# EAGLE design eblock expansion (EAGLE 5.04)
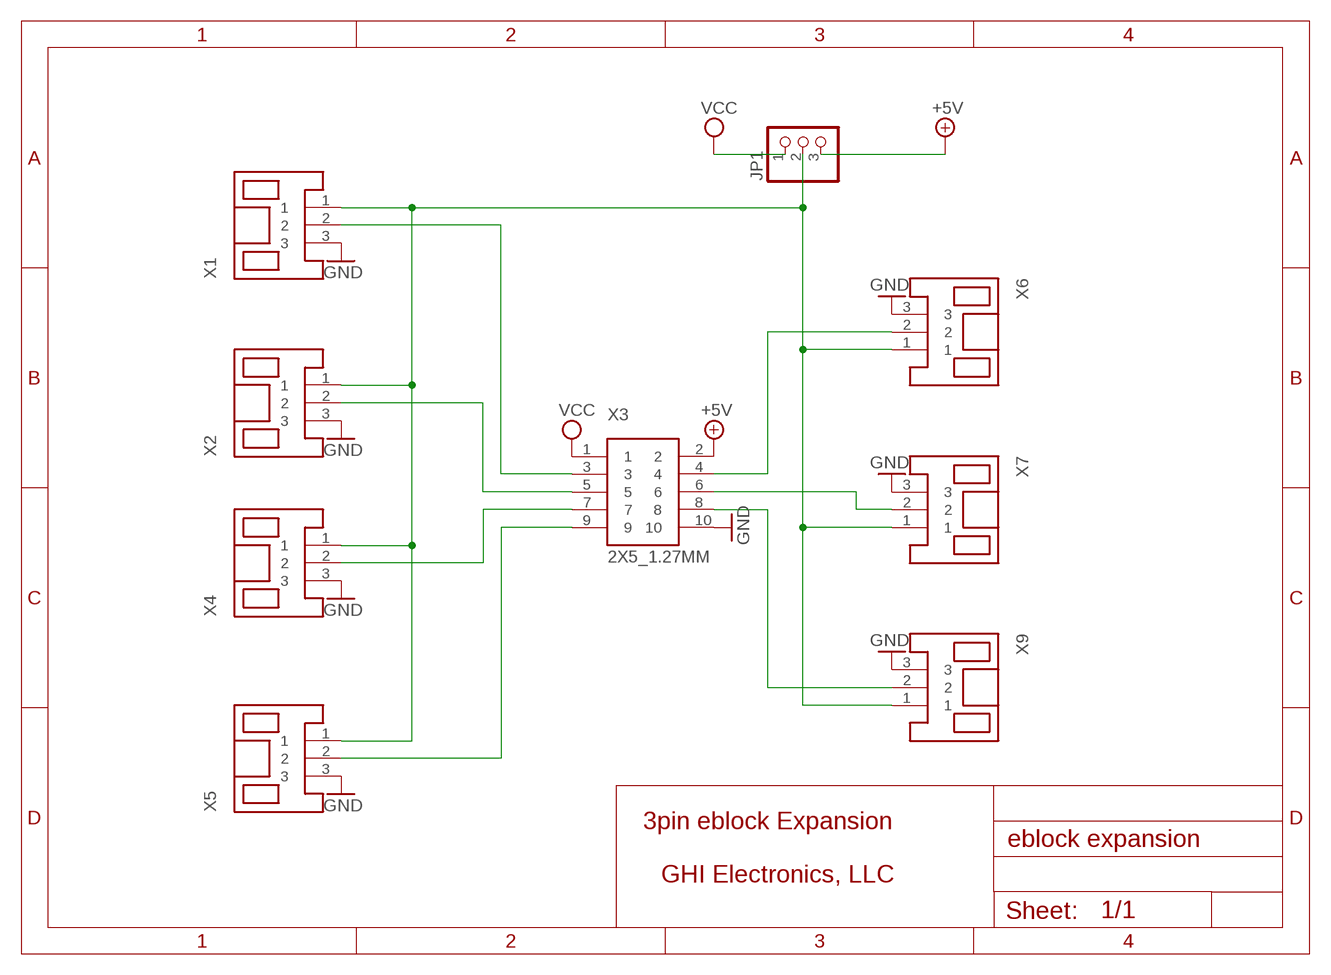
[diagram p0: schematic, sheet 1]

## Parts
JP1  PINHD-1X3  [1X03]
X1  JST3PIN_TH  [CON_JST_3PIN_TH]
X2  JST3PIN_TH  [CON_JST_3PIN_TH]
X3  2X5_1.27MM  [2X5_1.27MM]
X4  JST3PIN_TH  [CON_JST_3PIN_TH]
X5  JST3PIN_TH  [CON_JST_3PIN_TH]
X6  JST3PIN_TH  [CON_JST_3PIN_TH]
X7  JST3PIN_TH  [CON_JST_3PIN_TH]
X9  JST3PIN_TH  [CON_JST_3PIN_TH]

## Nets
+5V [power]: JP1.3 X3.2
GND [power]: X1.3 X2.3 X3.10 X4.3 X5.3 X6.3 X7.3 X9.3
N$1: X1.2 X3.3
N$2: X2.2 X3.5
N$3: X3.7 X4.2
N$4: X3.9 X5.2
N$5: X3.4 X6.2
N$6: X3.8 X9.2
N$7: X3.6 X7.2
N$8: JP1.2 X1.1 X2.1 X4.1 X5.1 X6.1 X7.1 X9.1
VCC [power]: JP1.1 X3.1

## Notes on the sheet
- 3pin eblock Expansion
- GHI Electronics, LLC

## Library data of the parts
JP1 = pinhead:PINHD-1X3: PIN HEADER
X1 X2 X4-X7 X9 = GHI:JST3PIN_TH
X3 = GHI:2X5_1.27MM

## Net classes
0 default: width 0.254 mm, drill 0.381 mm, clearance 0.203 mm

## Board
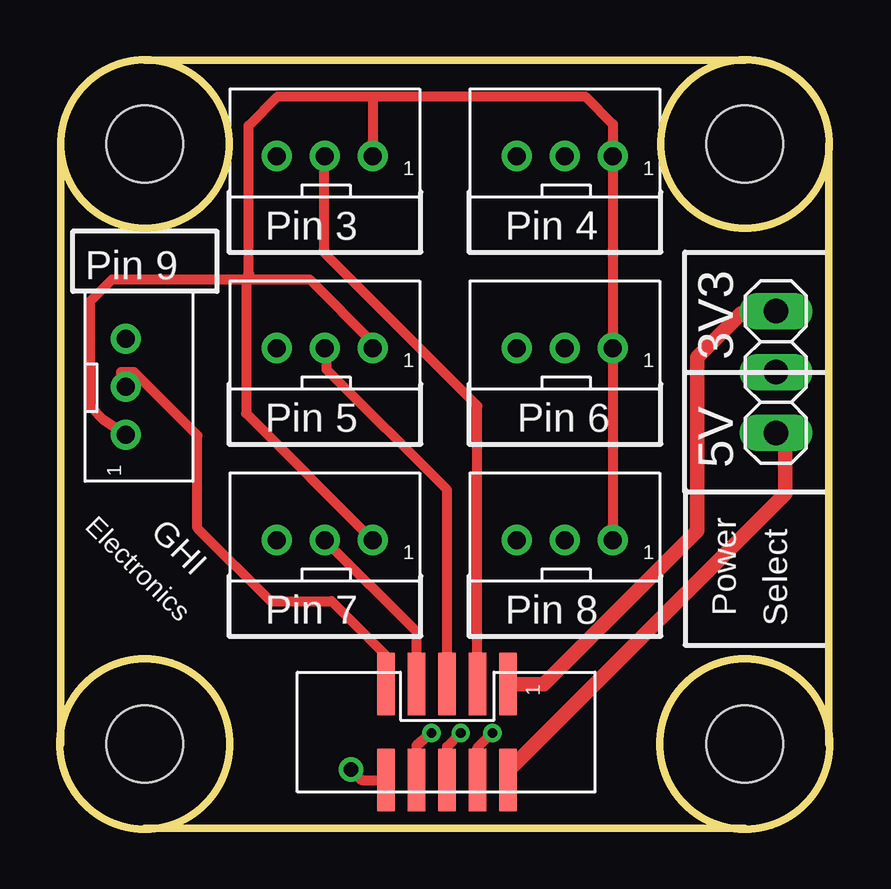
[diagram p1: board, top side]
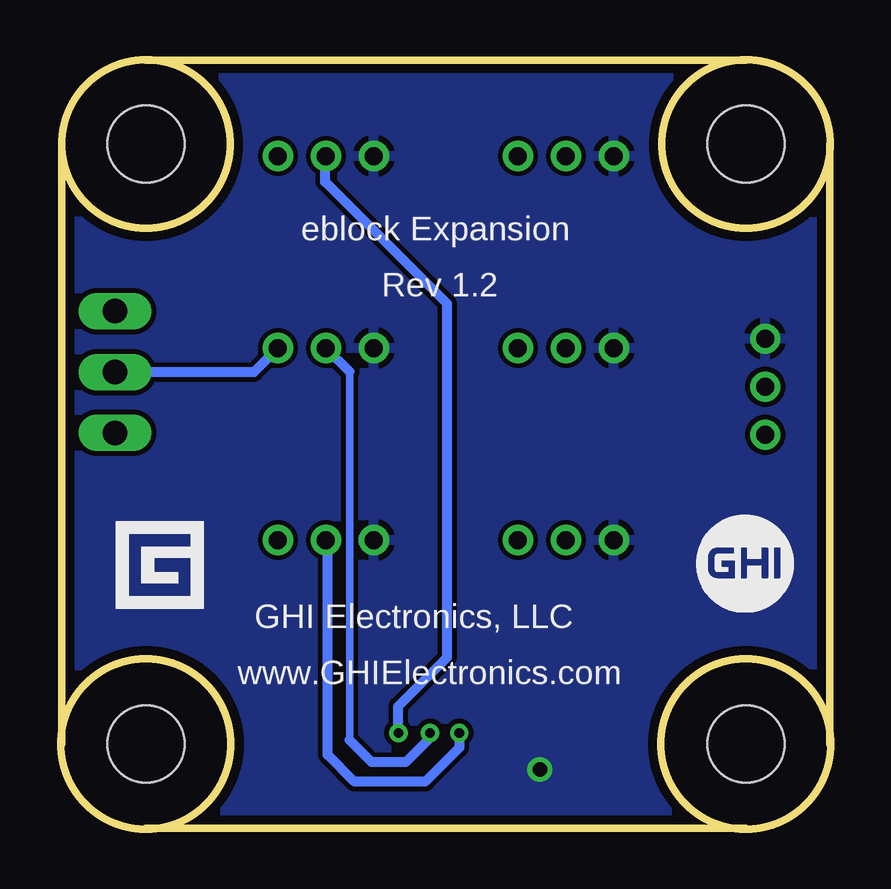
[diagram p2: board, bottom side, seen from below]

Size 32.07 x 32.04 mm. Coordinates in mm from the lower left corner, seen from the top.
Outline: 32.04,3.54 32.04,28.54
Outline: 0.04,28.54 0.04,3.54
Outline: 3.54,32.04 28.54,32.04
Outline: 28.54,0.04 3.54,0.04
Outline: circle at 3.54,28.54 radius 3.5
Outline: circle at 28.54,28.54 radius 3.5
Outline: circle at 28.54,3.54 radius 3.54
Outline: circle at 3.54,3.54 radius 3.54
Copper layers (1+16): Top 0.035mm / dielectric 1.5mm / Bottom 0.035mm
Design rules "default *": minimum track width 8mil, minimum drill 12mil, track to track 8mil, track to pad 8mil, pad to pad 8mil, via to via 8mil, smd to smd 8mil, copper to edge 15mil, drill to drill 8mil, minimum pad ring 10mil, minimum via ring 7mil, stop-mask expansion 4mil, vias tented up to drill 50mil, thermal gap 10mil
Holes 3.2 mm at 3.54,3.54 28.54,28.54 3.54,28.54 28.54,3.54

### Footprints (pad centres in the part's own frame; a part is rotated, then mirrored left to right if it is on the bottom)
1X03 = drill 1.016 long: 1 -2.54,0; 2 0,0; 3 2.54,0
CON_JST_3PIN_TH = drill 0.75 round: 1 2,0; 2 0,0; 3 -2,0
2X5_1.27MM = smd 2.6 x 0.74: 1 -2,2.58; 2 2,2.58; 3 -2,1.31; 4 2,1.31; 5 -2,0.04; 6 2,0.04; 7 -2,-1.23; 8 2,-1.23; 9 -2,-2.5; 10 2,-2.5

### Placement (x,y rotation side)
JP1  29.83,19.04 270 top
X1  11.04,28.04 0 top
X2  11.04,20.04 0 top
X3  16.09,4.03 270 top
X4  11.04,12.04 0 top
X5  2.74,18.43 270 top
X6  21.04,28.04 0 top
X7  21.04,20.04 0 top
X9  21.04,12.04 0 top

### Tracks (layer width: path | path; a pad name or v marks a point on that pad's centre or on a via)
+5V
  Top 0.61: X3.2 18.67,2.41 30.21,13.95 30.21,16.32 JP1.3
GND  (via drill 0.61)
  Top 0.406: X3.10 12.57,2.03 v12.13,2.47
  pour Bottom: 0.24,31.84 0.24,0.34 31.84,0.24 31.84,31.73
N$1
  Top 0.406: X3.3 17.4,17.63 11.01,24.01 11.01,28.01 X1.2
N$2
  Top 0.406: X3.5 16.13,14.12 11.11,19.14 11.11,19.96 X2.2
N$3
  Top 0.406: X3.7 14.86,8.22 X4.2
N$4
  Top 0.406: X3.9 13.59,7.21 11.31,9.48 8.77,9.48 5.73,12.53 5.73,16.39 3.08,19.03 2.54,19.03 X5.2
N$5  (via drill 0.41)
  Top 0.406: X3.4 17.4,3.37 v18.02,4
  Bottom 0.406: v18.02,4 18.02,5.12 15.99,7.15 15.99,21.88 21.07,26.96 21.07,28.08 20.97,28.07 X6.2
N$6  (via drill 0.41)
  Top 0.406: X3.8 14.86,3.48 v15.48,4
  Bottom 0.406: v15.48,4 15.48,3.39 16.9,1.97 19.85,1.97 20.97,3.08 20.97,11.97 X9.2
N$7  (via drill 0.41)
  Top 0.406: X3.6 16.13,3.43 v16.7,4
  Bottom 0.305: 20.05,3.69 20.05,19.05
  Bottom 0.406: v16.7,4 16.7,3.79 17.71,2.78 19.14,2.78 20.05,3.69 | 20.05,19.05 X7.2
N$8
  Top 0.406: X9.1 X7.1 X6.1 23.04,29.36 21.88,30.52 13.04,30.52 | 13.04,30.52 9.08,30.52 7.86,29.3 7.86,23.2 | 7.76,22.9 7.76,17.31 X4.1 | 7.76,22.9 7.86,23.2 | X5.1 1.83,17.04 1.25,17.61 1.25,21.98 2.17,22.9 7.76,22.9 | X2.1 13.04,20.26 10.4,22.9 7.96,22.9 7.86,23.2 | X1.1 13.04,30.51 13.04,30.52
  Bottom 0.406: JP1.2 24.04,19.04 X7.1
VCC
  Top 0.61: X3.1 20.15,6.03 26.55,12.43 26.55,19.64 28.38,21.47 29.93,21.47 JP1.1

### Text on the board
tPlace: Pin 3 | Pin 4 | Pin 9 | 3V3 | Pin 5 | Pin 6 | 5V | Electronics | GHI | Power | Pin 7 | Pin 8 | Select
bPlace: eblock Expansion | Rev 1.2 | GHI Electronics, LLC | www.GHIElectronics.com